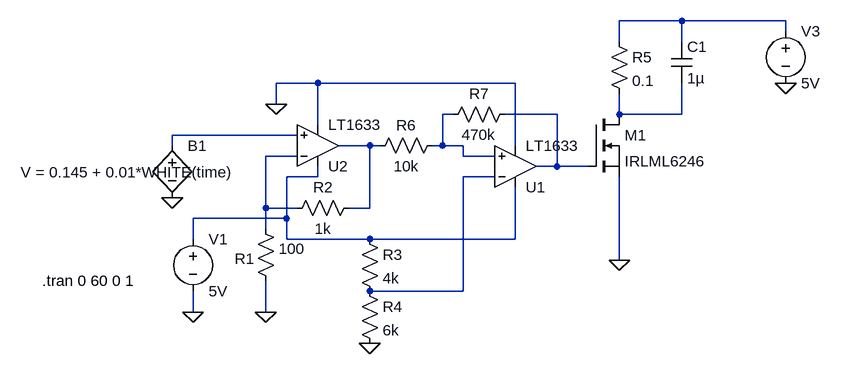
[diagram p0: schematic analog_temperature_control.asc]
analog_temperature_control.asc, the LTspice schematic file:
Version 4
SHEET 1 1672 680
WIRE 1056 -48 960 -48
WIRE 1216 -48 1056 -48
WIRE 1216 -32 1216 -48
WIRE 960 -16 960 -48
WIRE 1056 -16 1056 -48
WIRE 496 48 432 48
WIRE 800 48 496 48
WIRE 432 80 432 48
WIRE 704 96 688 96
WIRE 864 96 784 96
WIRE 960 96 960 64
WIRE 1056 96 1056 48
WIRE 1056 96 960 96
WIRE 496 112 496 48
WIRE 960 112 960 96
WIRE 464 128 272 128
WIRE 272 144 272 128
WIRE 576 144 528 144
WIRE 592 144 576 144
WIRE 688 144 688 96
WIRE 688 144 672 144
WIRE 720 144 688 144
WIRE 800 144 800 48
WIRE 464 160 416 160
WIRE 720 160 720 144
WIRE 768 160 720 160
WIRE 864 176 864 96
WIRE 864 176 832 176
WIRE 912 176 864 176
WIRE 496 192 496 176
WIRE 496 192 448 192
WIRE 768 192 720 192
WIRE 416 240 416 160
WIRE 464 240 416 240
WIRE 576 240 576 144
WIRE 576 240 544 240
WIRE 448 256 448 192
WIRE 448 256 304 256
WIRE 416 272 416 240
WIRE 304 288 304 256
WIRE 448 288 448 256
WIRE 576 288 448 288
WIRE 800 288 800 208
WIRE 800 288 576 288
WIRE 960 320 960 192
WIRE 720 368 720 192
WIRE 720 368 576 368
WIRE 304 400 304 368
WIRE 416 400 416 352
FLAG 272 224 0
FLAG 416 400 0
FLAG 304 400 0
FLAG 432 80 0
FLAG 576 448 0
FLAG 960 320 0
FLAG 1216 48 0
SYMBOL bv 272 128 R0
WINDOW 3 -233 57 Left 2
SYMATTR Value V = 0.145 + 0.01*WHITE(time)
SYMATTR InstName B1
SYMBOL res 432 368 R180
WINDOW 0 33 50 Left 2
WINDOW 3 -44 65 Left 2
SYMATTR InstName R1
SYMATTR Value 100
SYMBOL res 448 256 R270
WINDOW 0 32 56 VTop 2
WINDOW 3 0 56 VBottom 2
SYMATTR InstName R2
SYMATTR Value 1k
SYMBOL voltage 304 272 R0
WINDOW 123 0 0 Left 0
WINDOW 39 0 0 Left 0
SYMATTR InstName V1
SYMATTR Value 5V
SYMBOL OpAmps\\LT1633 496 208 M180
SYMATTR InstName U2
SYMBOL OpAmps\\LT1633 800 240 M180
SYMATTR InstName U1
SYMBOL res 560 272 R0
SYMATTR InstName R3
SYMATTR Value 4k
SYMBOL res 560 352 R0
SYMATTR InstName R4
SYMATTR Value 6k
SYMBOL nmos 912 96 R0
SYMATTR InstName M1
SYMATTR Value IRLML6246
SYMBOL voltage 1216 -48 R0
WINDOW 123 0 0 Left 0
WINDOW 39 0 0 Left 0
SYMATTR InstName V3
SYMATTR Value 5V
SYMBOL res 944 -32 R0
SYMATTR InstName R5
SYMATTR Value 0.1
SYMBOL cap 1040 -16 R0
SYMATTR InstName C1
SYMATTR Value 1µ
SYMBOL res 688 128 R90
WINDOW 0 0 56 VBottom 2
WINDOW 3 32 56 VTop 2
SYMATTR InstName R6
SYMATTR Value 10k
SYMBOL res 800 80 R90
WINDOW 0 0 56 VBottom 2
WINDOW 3 32 56 VTop 2
SYMATTR InstName R7
SYMATTR Value 470k
TEXT 72 352 Left 2 !.tran 0 60 0 1

The netlist it stands for:
* analog_temperature_control.asc
B1 N005 0 V = 0.145 + 0.01*WHITE(time)
R1 0 N007 100
R2 N007 N006 1k
V1 N008 0 5V
XU2 N005 N007 N008 0 N006 LT1633  ; pins In+ In- V+ V- OUT
XU1 N002 N009 N008 0 N003 LT1633  ; pins In+ In- V+ V- OUT
R3 N008 N009 4k
R4 N009 0 6k
M1 N004 N003 0 0 IRLML6246
V3 N001 0 5V
R5 N001 N004 0.1
C1 N001 N004 1µ
R6 N002 N006 10k
R7 N003 N002 470k
.model NMOS NMOS
.model PMOS PMOS
.lib standard.mos
.tran 0 60 0 1
.backanno
.end